# Altium schematic sheet SuperClock_Core_WIFI.SchDoc
size A4; Organization: Altium Limited; Address1: L3, 12a Rodborough Rd; Address2: Frenchs Forest; Address3: NSW; Address4: Australia 2086
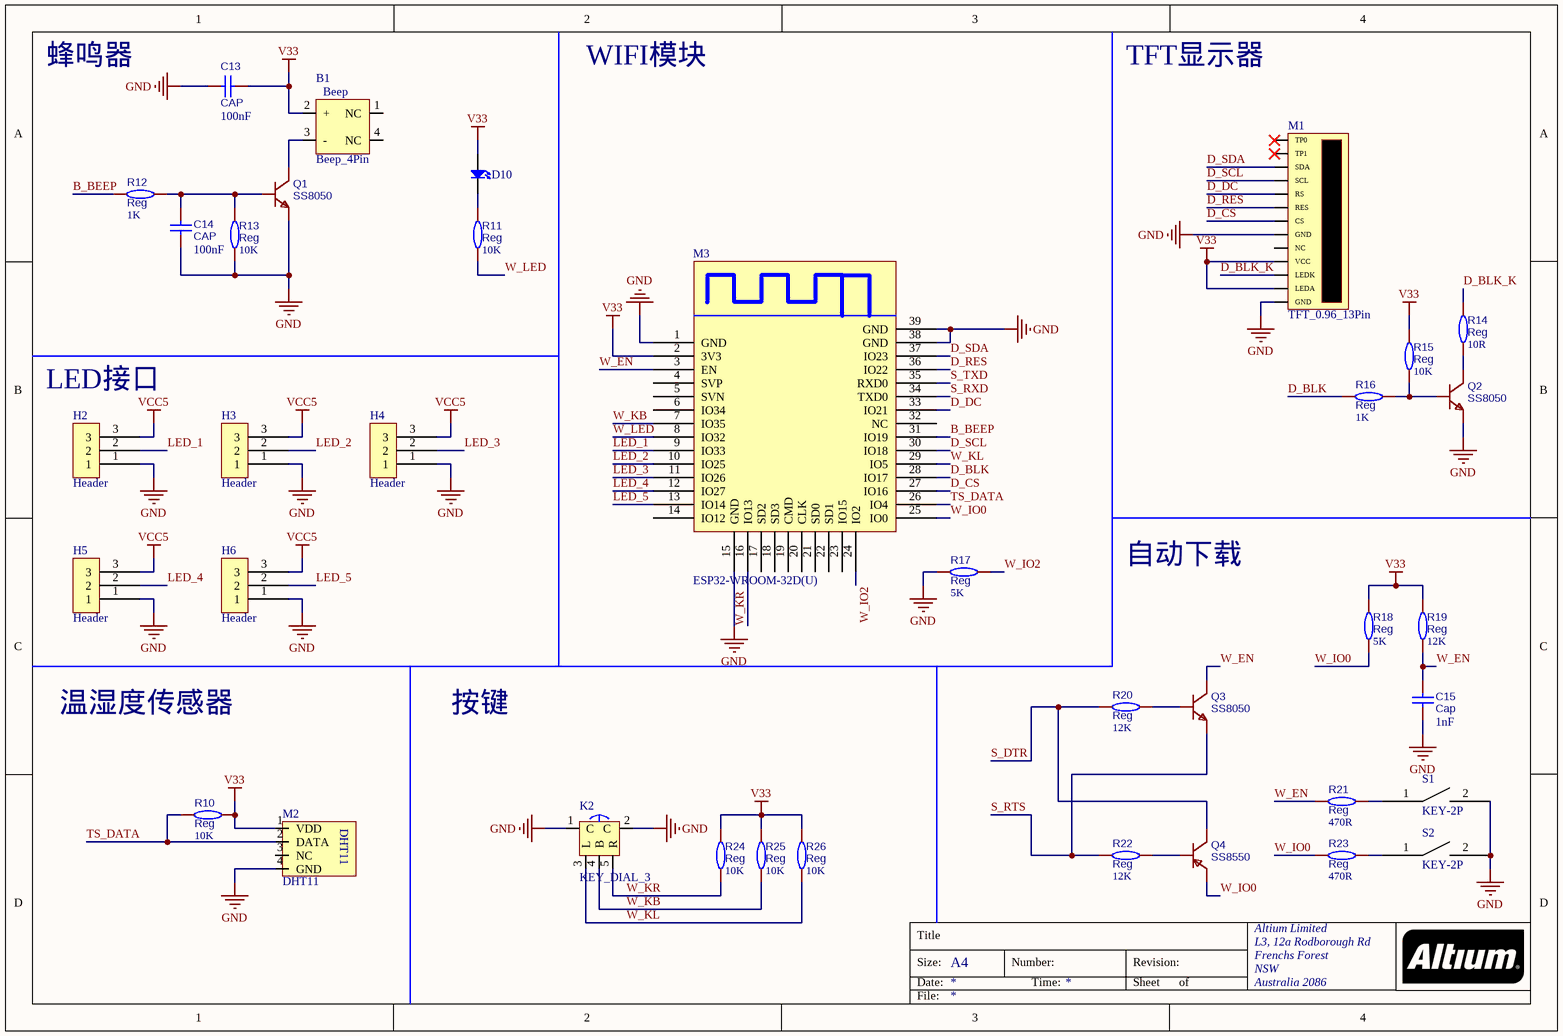
[diagram p0: SuperClock_Core_WIFI.SchDoc]

## Parts
B1  Beep_4Pin  [Beep_4Pin_7525]
C13  CAP  value 100nF  [C0603]
C14  CAP  value 100nF  [C0603]
C15  Cap  value 1nF  [C0603]
D10  LED  [LED0603]  (value not drawn)
H2  Header  [H_2.54_P3]
H3  Header  [H_2.54_P3]
H4  Header  [H_2.54_P3]
H5  Header  [H_2.54_P3]
H6  Header  [H_2.54_P3]
K2  KEY_DIAL_3  [KEY_DIAL_3]
M1  TFT_0.96_13Pin  [TFT_0.96_13Pin]
M2  DHT11  [SENSOR-TH_DHT11-HOR]
M3  ESP32-WROOM-32D(U)  [ESP32-WROOM-32D]
Q1  SS8050  [SOT-23-3]
Q2  SS8050  [SOT-23-3]
Q3  SS8050  [SOT-23-3]
Q4  SS8550  [SOT-23-3]
R10  Reg  value 10K  [R0603]
R11  Reg  value 10K  [R0603]
R12  Reg  value 1K  [R0603]
R13  Reg  value 10K  [R0603]
R14  Reg  value 10R  [R0603]
R15  Reg  value 10K  [R0603]
R16  Reg  value 1K  [R0603]
R17  Reg  value 5K  [R0603]
R18  Reg  value 5K  [R0603]
R19  Reg  value 12K  [R0603]
R20  Reg  value 12K  [R0603]
R21  Reg  value 470R  [R0603]
R22  Reg  value 12K  [R0603]
R23  Reg  value 470R  [R0603]
R24  Reg  value 10K  [R0603]
R25  Reg  value 10K  [R0603]
R26  Reg  value 10K  [R0603]
S1  KEY-2P  [KEY_SOT_P2]
S2  KEY-2P  [KEY_SOT_P2]

## Nets
GND: C13.1 C14.2 C15.2 H2.1 H3.1 H4.1 H5.1 H6.1 K2.1(C) K2.2(C) M1.8(GND) M1.13(GND) M2.4(GND) M3.1(GND) M3.15(GND) M3.38(GND) M3.39(GND) Q1.2(E) Q2.2(E) R13.2 R17.2 S1.2 S2.2
V33: B1.2(+) C13.2 D10.2(A) M1.10(VCC) M1.12(LEDA) M2.1(VDD) M3.2(3V3) R10.1 R15.2 R18.2 R19.2 R24.1 R25.1 R26.1
VCC5: H2.3 H3.3 H4.3 H5.3 H6.3
B_BEEP: M3.31(IO19) R12.2
D_BLK: M3.28(IO17) R16.2
D_BLK_K: M1.11(LEDK) R14.2
D_CS: M1.7(CS) M3.27(IO16)
D_DC: M1.5(RS) M3.33(IO21)
D_RES: M1.6(RES) M3.36(IO22)
D_SCL: M1.4(SCL) M3.30(IO18)
D_SDA: M1.3(SDA) M3.37(IO23)
LED_1: H2.2 M3.9(IO33)
LED_2: H3.2 M3.10(IO25)
LED_3: H4.2 M3.11(IO26)
LED_4: H5.2 M3.12(IO27)
LED_5: H6.2 M3.13(IO14)
S_DTR: Q4.3(C) R20.2
S_RTS: Q3.2(E) R22.2
S_RXD: M3.34(TXD0)
S_TXD: M3.35(RXD0)
TS_DATA: M2.2(DATA) M3.26(IO4) R10.2
W_EN: C15.1 M3.3(EN) Q3.3(C) R19.1 R21.2
W_IO0: M3.25(IO0) Q4.2(E) R18.1 R23.2
W_IO2: M3.24(IO2) R17.1
W_KB: K2.4(B) M3.7(IO35) R25.2
W_KL: K2.3(L) M3.29(IO5) R26.2
W_KR: K2.5(R) M3.16(IO13) R24.2
W_LED: M3.8(IO32) R11.1
NetB1_3: B1.3(-) Q1.3(C)
NetC14_1: C14.1 Q1.1(B) R12.1 R13.1
NetD10_1: D10.1(K) R11.2
NetQ2_1: Q2.1(B) R15.1 R16.1
NetQ2_3: Q2.3(C) R14.1
NetQ3_1: Q3.1(B) R20.1
NetQ4_1: Q4.1(B) R22.1
NetR21_1: R21.1 S1.1
NetR23_1: R23.1 S2.1

Not connected (* = marked no-connect by the designer): B1 1(NC) 4(NC); M1 1(TP0)* 2(TP1)* 9(NC); M2 3(NC); M3 4(SVP) 5(SVN) 6(IO34) 14(IO12) 17(SD2) 18(SD3) 19(CMD) 20(CLK) 21(SD0) 22(SD1) 23(IO15) 32(NC)

## Notes on the sheet
- 蜂鸣器
- WIFI模块
- TFT显示器
- (near H2) LED接口
- 自动下载
- 温湿度传感器
- 按键
- Title
- Size:
- Date:
- A4
- Number:
- Time:
- Revision:
- Sheet
- of
- File:
- (in symbol Beep_4Pin) Beep

## Library data of the parts
B1 = Beep_4Pin: 4Pin蜂鸣器
C13-C15 = CAP: BOM_Manufacturer: Huaxin S&T; BOM_Manufacturer Part: 0603B103K101CT; nameAlias: Capacitance; Contributor: LCSC; BOM_Supplier: LCSC; BOM_Supplier Part: C302008; spicePre: C; spiceSymbolName: 0603B103K101CT
D10 = LED0: Published: 8-Jun-2000; LatestRevisionDate: 08-Jul-2005; LatestRevisionNote: Mech Layer 1 removed.; PackageReference: LED-0; Publisher: Altium Limited; PackageDescription: LED; 2 Leads
H2-H6 = Header_P3: 3Pin接口
K2 = KEY_DIAL_3: 3向拨轮开关
M1 = TFT_0.96_13Pin: ST7735_TFT
M2 = DHT11: 温湿度传感器
Q1-Q3 = SS8050: NPN; BOM_Manufacturer: AnBon; Contributor: LCSC; BOM_Paste Type: recommend; BOM_Supplier: LCSC; BOM_Supplier Part: C541705; BOM_Manufacturer Part: SS8050; spicePre: Q; spiceSymbolName: SS8050_C541705
Q4 = SS8550: PNP; BOM_Manufacturer: AnBon; Contributor: LCSC; BOM_Supplier: LCSC; BOM_Supplier Part: C541706; BOM_Manufacturer Part: SS8550; spicePre: Q; spiceSymbolName: SS8550_C541706
R10-R26 = Res: 电阻; BOM_Manufacturer: Viking Tech; BOM_Manufacturer Part: AR03BTCX1002A; nameAlias: Resistance (Ohms); Contributor: LCSC; BOM_Supplier: LCSC; BOM_Supplier Part: C465721; spicePre: R; spiceSymbolName: AR03BTCX1002A
S1 S2 = KEY_2P: KEY-2Pp